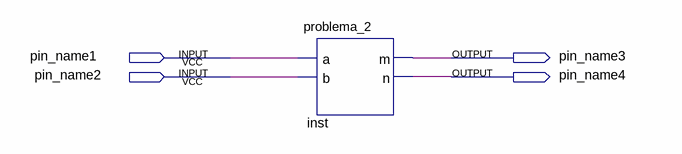
[diagram p0: schematic sheet]
// Quartus schematic Top.bdf as structural Verilog: 1 symbols, 4 pins
module Top (
  input  pin_name1,
  input  pin_name2,
  output pin_name3,
  output pin_name4
);

  problema_2 inst (.a(pin_name1), .b(pin_name2), .m(pin_name3), .n(pin_name4));
endmodule
